# Altium schematic sheet Radio.SchDoc
size Legal
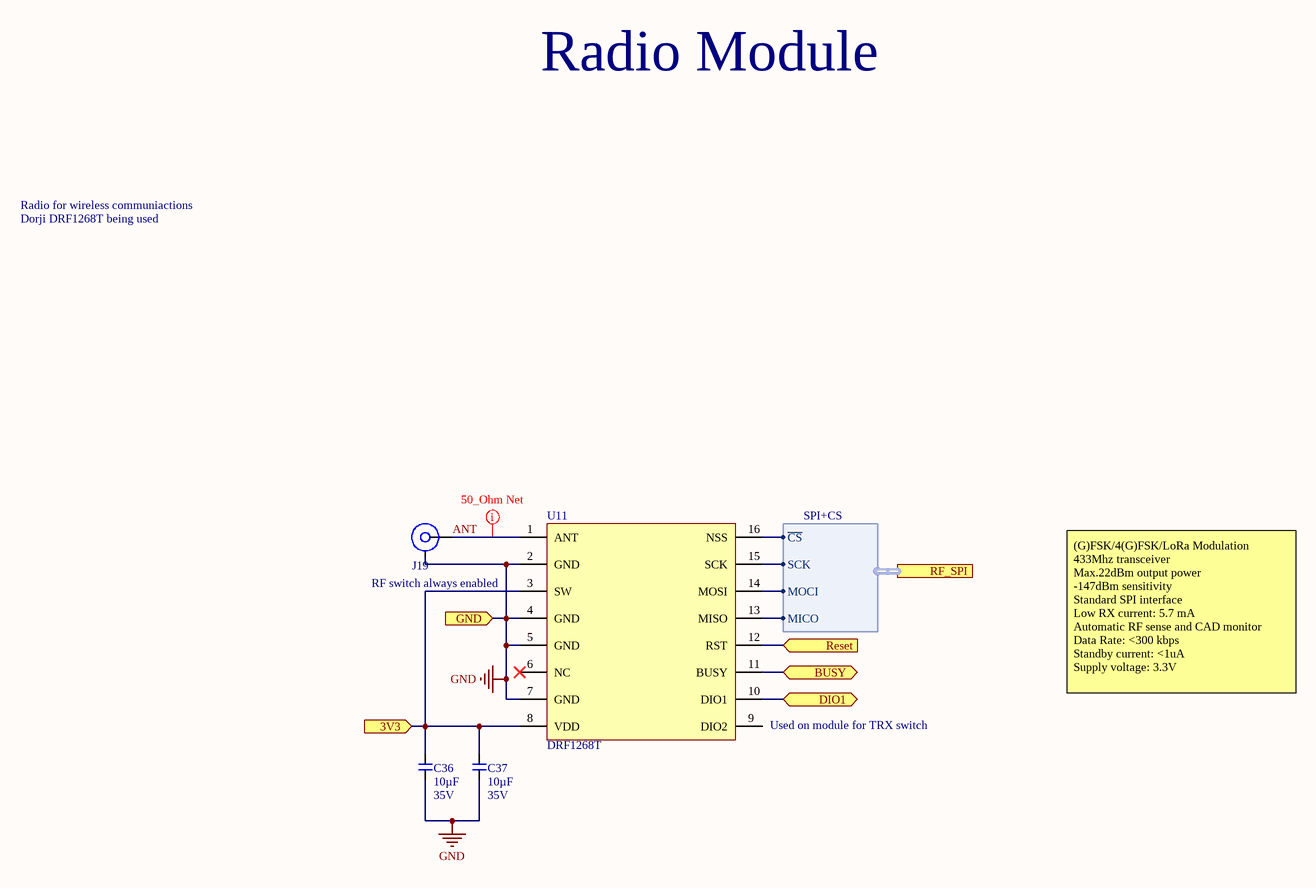
[diagram p0: Radio.SchDoc]

## Parts
C36  Capacitance (shorthand): 10µF  Rated Voltage: 35V  [C0603]  (hidden comment: 490-13248-1-ND)
C37  Capacitance (shorthand): 10µF  Rated Voltage: 35V  [C0603]  (hidden comment: 490-13248-1-ND)
J19  SMA_SAMTEC_TH_RA  [SMA_SAMTEC_SMA-J-P-X-RA-TH1]  (value not drawn)
U11  DRF1268T  [DRF1268T]

## Ports
3V3 (in), BUSY (bidir), DIO1 (bidir), GND (in), Reset (in), RF_SPI (harness SPI+CS)

## Harnesses
SPI+CS: SCK, MOCI, MICO, ~{CS}

## Nets
GND: C36.2 C37.2 J19.GND U11.2(GND) U11.4(GND) U11.5(GND) U11.7(GND) ; port GND
3V3: C36.1 C37.1 U11.3(SW) U11.8(VDD) ; port 3V3
ANT: J19.SIG U11.1(ANT)
BUSY: U11.11(BUSY) ; port BUSY
DIO1: U11.10(DIO1) ; port DIO1
Reset: U11.12(RST) ; port Reset
NetU11_13: U11.13(MISO) ; port RF_SPI.MICO
NetU11_14: U11.14(MOSI) ; port RF_SPI.MOCI
NetU11_15: U11.15(SCK) ; port RF_SPI.SCK
NetU11_16: U11.16(NSS) ; port RF_SPI.~{CS}

Not connected (* = marked no-connect by the designer): U11 6(NC)* 9(DIO2)

## Layout directives
rule Clearance Constraint [Generic clearance = 0mil, and 21 value(s) for objects]: ANT

## Notes on the sheet
- Radio Module
- Radio for wireless communiactions
- Dorji DRF1268T being used
- RF switch always enabled
- (near U11) Used on module for TRX switch
- (G)FSK/4(G)FSK/LoRa Modulation
  433Mhz transceiver
  Max.22dBm output power
  -147dBm sensitivity
  Standard SPI interface
  Low RX current: 5.7 mA
  Automatic RF sense and CAD monitor
  Data Rate: <300 kbps
  Standby current: <1uA
  Supply voltage: 3.3V
- PROJECT
- SHEET
- Powered By
- Sheet
- of
- REVISION
- ssi.stanford.edu
- ENGINEER
- REVIEWER
- REVIEWED ON

## Library data of the parts
C36 C37 = CMP-119-0071-1: CAP CER 10UF 35V X5R 0603 20%; Manufacturer: Murata Electronics North America; Capacitance - pF (Machine readable): #NAME?; Dielectric: X5R
J19 = CMP-030-0020-1: Source: connector.SchLib; Design Item ID: SMA_SAMTEC_TH_RA
U11 = CMP-025-0002-1: Dorji DRF1268T LoRa Module with SX1262 IC and TCXO; Design Item ID: RFM_Module